# Altium schematic sheet hri_hand_v2.SchDoc
size A4
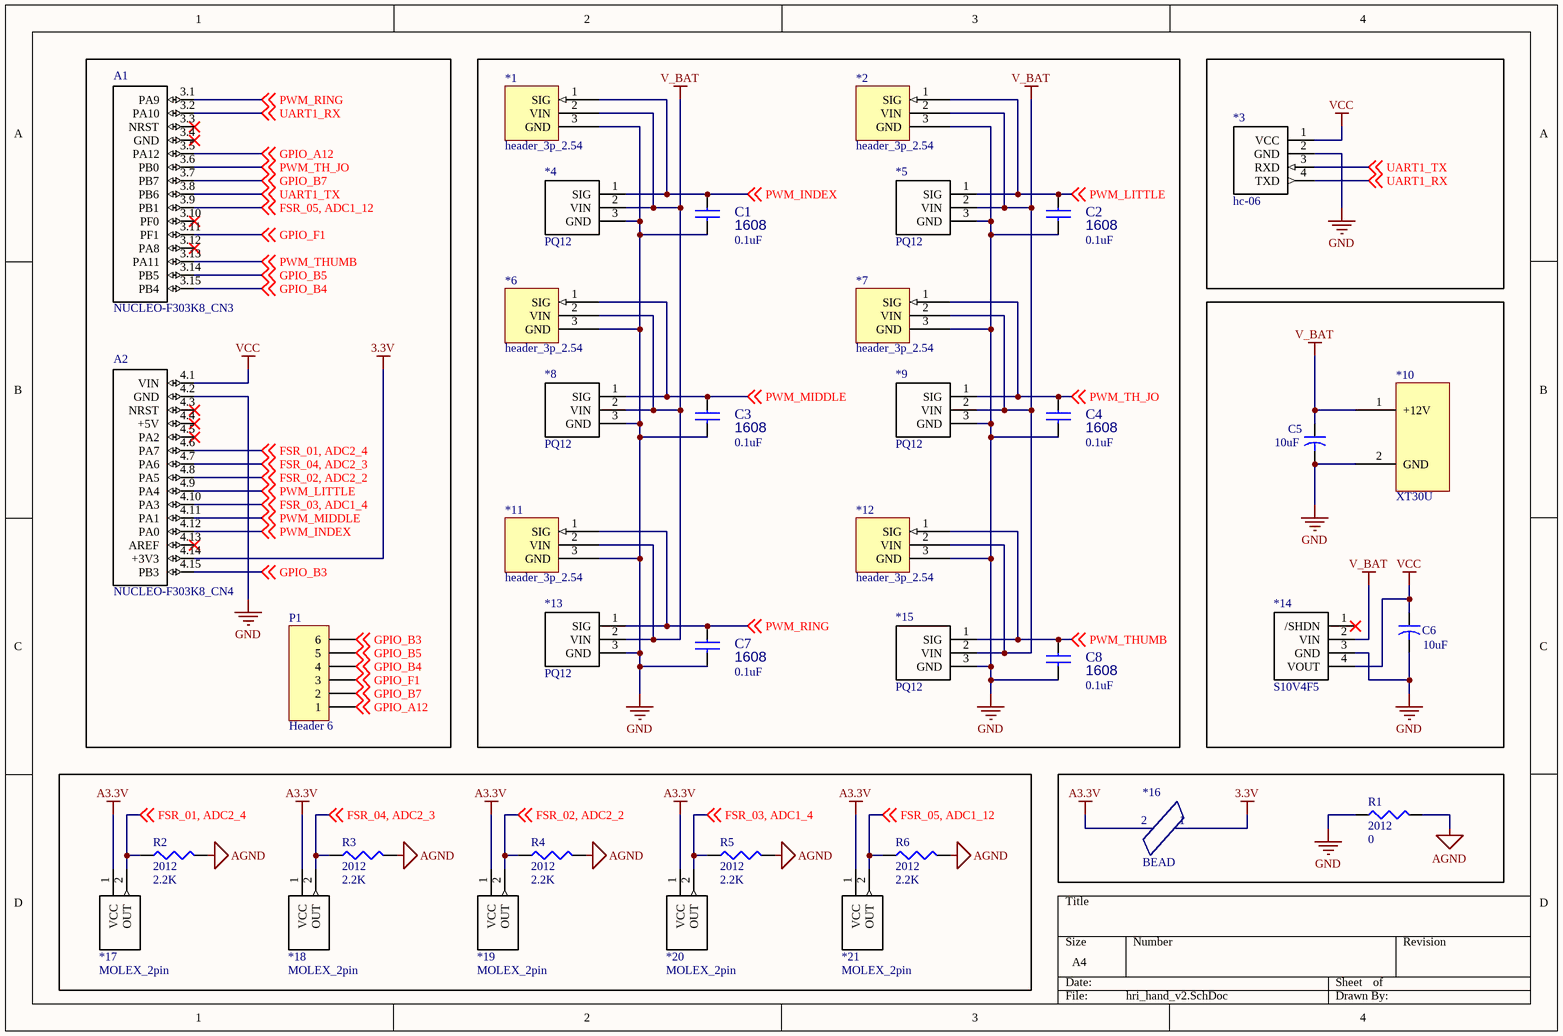
[diagram p0: hri_hand_v2.SchDoc]

## Parts
*1  header_3p_2.54  [header_3x1_2.54]
*2  header_3p_2.54  [header_3x1_2.54]
*3  hc-06  [header_4x1_2.54]
*4  PQ12  [molex_3p_2.54]
*5  PQ12  [molex_3p_2.54]
*6  header_3p_2.54  [header_3x1_2.54]
*7  header_3p_2.54  [header_3x1_2.54]
*8  PQ12  [molex_3p_2.54]
*9  PQ12  [molex_3p_2.54]
*10  XT30U  [XT30F]
*11  header_3p_2.54  [header_3x1_2.54]
*12  header_3p_2.54  [header_3x1_2.54]
*13  PQ12  [molex_3p_2.54]
*14  S10V4F5  [header_4x1_2.54]
*15  PQ12  [molex_3p_2.54]
*16  BEAD  [L-1608-SS]
*17  MOLEX_2pin  [molex_2p_2.54]
*18  MOLEX_2pin  [molex_2p_2.54]
*19  MOLEX_2pin  [molex_2p_2.54]
*20  MOLEX_2pin  [molex_2p_2.54]
*21  MOLEX_2pin  [molex_2p_2.54]
A1  NUCLEO-F303K8_CN3  [header_1*15_3]
A2  NUCLEO-F303K8_CN4  [header_1*15_4]
C1  1608  value 0.1uF  [CAP-1608-SS]
C2  1608  value 0.1uF  [CAP-1608-SS]
C3  1608  value 0.1uF  [CAP-1608-SS]
C4  1608  value 0.1uF  [CAP-1608-SS]
C5  value 10uF  [C-10UF/16V]
C6  value 10uF  [C-10UF/16V]
C7  1608  value 0.1uF  [CAP-1608-SS]
C8  1608  value 0.1uF  [CAP-1608-SS]
P1  Header 6  [HDR1X6]
R1  2012  value 0  [RES-2012]
R2  2012  value 2.2K  [RES-2012]
R3  2012  value 2.2K  [RES-2012]
R4  2012  value 2.2K  [RES-2012]
R5  2012  value 2.2K  [RES-2012]
R6  2012  value 2.2K  [RES-2012]

## Nets
3.3V: *16.1 A2.4.14(+3V3)
A3.3V: *16.2 *17.1(VCC) *18.1(VCC) *19.1(VCC) *20.1(VCC) *21.1(VCC)
AGND: R1.2 R2.2 R3.2 R4.2 R5.2 R6.2
GND: *1.3(GND) *2.3(GND) *3.2(GND) *4.3(GND) *5.3(GND) *6.3(GND) *7.3(GND) *8.3(GND) *9.3(GND) *10.2(GND) *11.3(GND) *12.3(GND) *13.3(GND) *14.3(GND) *15.3(GND) A2.4.2(GND) C1.2 C2.2 C3.2 C4.2 C5.2 C6.2 C7.2 C8.2 R1.1
V_BAT: *1.2(VIN) *2.2(VIN) *4.2(VIN) *5.2(VIN) *6.2(VIN) *7.2(VIN) *8.2(VIN) *9.2(VIN) *10.1(+12V) *11.2(VIN) *12.2(VIN) *13.2(VIN) *14.2(VIN) *15.2(VIN) C5.1
VCC: *3.1(VCC) *14.4(VOUT) A2.4.1(VIN) C6.1
FSR_01, ADC2_4: *17.2(OUT) A2.4.6(PA7) R2.1 ; off-sheet FSR_01, ADC2_4
FSR_02, ADC2_2: *19.2(OUT) A2.4.8(PA5) R4.1 ; off-sheet FSR_02, ADC2_2
FSR_03, ADC1_4: *20.2(OUT) A2.4.10(PA3) R5.1 ; off-sheet FSR_03, ADC1_4
FSR_04, ADC2_3: *18.2(OUT) A2.4.7(PA6) R3.1 ; off-sheet FSR_04, ADC2_3
FSR_05, ADC1_12: *21.2(OUT) A1.3.9(PB1) R6.1 ; off-sheet FSR_05, ADC1_12
GPIO_A12: A1.3.5(PA12) P1.1 ; off-sheet GPIO_A12
GPIO_B3: A2.4.15(PB3) P1.6 ; off-sheet GPIO_B3
GPIO_B4: A1.3.15(PB4) P1.4 ; off-sheet GPIO_B4
GPIO_B5: A1.3.14(PB5) P1.5 ; off-sheet GPIO_B5
GPIO_B7: A1.3.7(PB7) P1.2 ; off-sheet GPIO_B7
GPIO_F1: A1.3.11(PF1) P1.3 ; off-sheet GPIO_F1
PWM_INDEX: *1.1(SIG) *4.1(SIG) A2.4.12(PA0) C1.1 ; off-sheet PWM_INDEX
PWM_LITTLE: *2.1(SIG) *5.1(SIG) A2.4.9(PA4) C2.1 ; off-sheet PWM_LITTLE
PWM_MIDDLE: *6.1(SIG) *8.1(SIG) A2.4.11(PA1) C3.1 ; off-sheet PWM_MIDDLE
PWM_RING: *11.1(SIG) *13.1(SIG) A1.3.1(PA9) C7.1 ; off-sheet PWM_RING
PWM_TH_JO: *7.1(SIG) *9.1(SIG) A1.3.6(PB0) C4.1 ; off-sheet PWM_TH_JO
PWM_THUMB: *12.1(SIG) *15.1(SIG) A1.3.13(PA11) C8.1 ; off-sheet PWM_THUMB
UART1_RX: *3.4(TXD) A1.3.2(PA10) ; off-sheet UART1_RX
UART1_TX: *3.3(RXD) A1.3.8(PB6) ; off-sheet UART1_TX

Not connected (* = marked no-connect by the designer): *14 1(/SHDN)*; A1 3.3(NRST)* 3.4(GND)* 3.10(PF0)* 3.12(PA8)*; A2 4.3(NRST)* 4.4(+5V)* 4.5(PA2)* 4.13(AREF)*

## Library data of the parts
A1 = NUCLEO-F303K8_CN3: STM32 Nucleo-32 development board with STM32F303K8T6 MCU, supports Arduino connectivity; MF: STMicroelectronics; MP: NUCLEO-F303K8; Digi-Key_Purchase_URL: https://www.digikey.kr/product-detail/en/stmicroelectronics/NUCLEO-F303K8/497-15981-ND/5428805?utm_source=snapeda&utm_medium=aggregator&utm_campaign=symbol; SnapEDA_Link: https://www.snapeda.com/parts/NUCLEO-F303K8/STMicroelectronics/view-part/?ref=snap; Package: None; Digi-Key_Part_Number: 497-15981-ND; Value: *
A2 = NUCLEO-F303K8_CN4: STM32 Nucleo-32 development board with STM32F303K8T6 MCU, supports Arduino connectivity; MF: STMicroelectronics; MP: NUCLEO-F303K8; Digi-Key_Purchase_URL: https://www.digikey.kr/product-detail/en/stmicroelectronics/NUCLEO-F303K8/497-15981-ND/5428805?utm_source=snapeda&utm_medium=aggregator&utm_campaign=symbol; SnapEDA_Link: https://www.snapeda.com/parts/NUCLEO-F303K8/STMicroelectronics/view-part/?ref=snap; Package: None; Digi-Key_Part_Number: 497-15981-ND; Value: *
C1-C4 C7 C8 = CAP NP
C5 C6 = Cap2: Capacitor; Published: 23-Sep-2002; PackageReference: CAPR5-4X5; Publisher: Altium Limited; PackageDescription: Capacitor; 2 Leads
P1 = Header 6: Header, 6-Pin; LatestRevisionDate: 17-Jul-2002; LatestRevisionNote: Re-released for DXP Platform.; Publisher: Altium Limited
R1-R6 = Res3: Resistor; Published: 8-Jun-2000; LatestRevisionDate: 29-May-2009; LatestRevisionNote: IPC-7351 Footprint Added.; PackageReference: J1-0603; Publisher: Altium Limited; PackageDescription: Chip Resistor